# EAGLE schematic All-in-one Starter Kit for Arduino Nano R4 V1.0 (EAGLE 9.6.2)
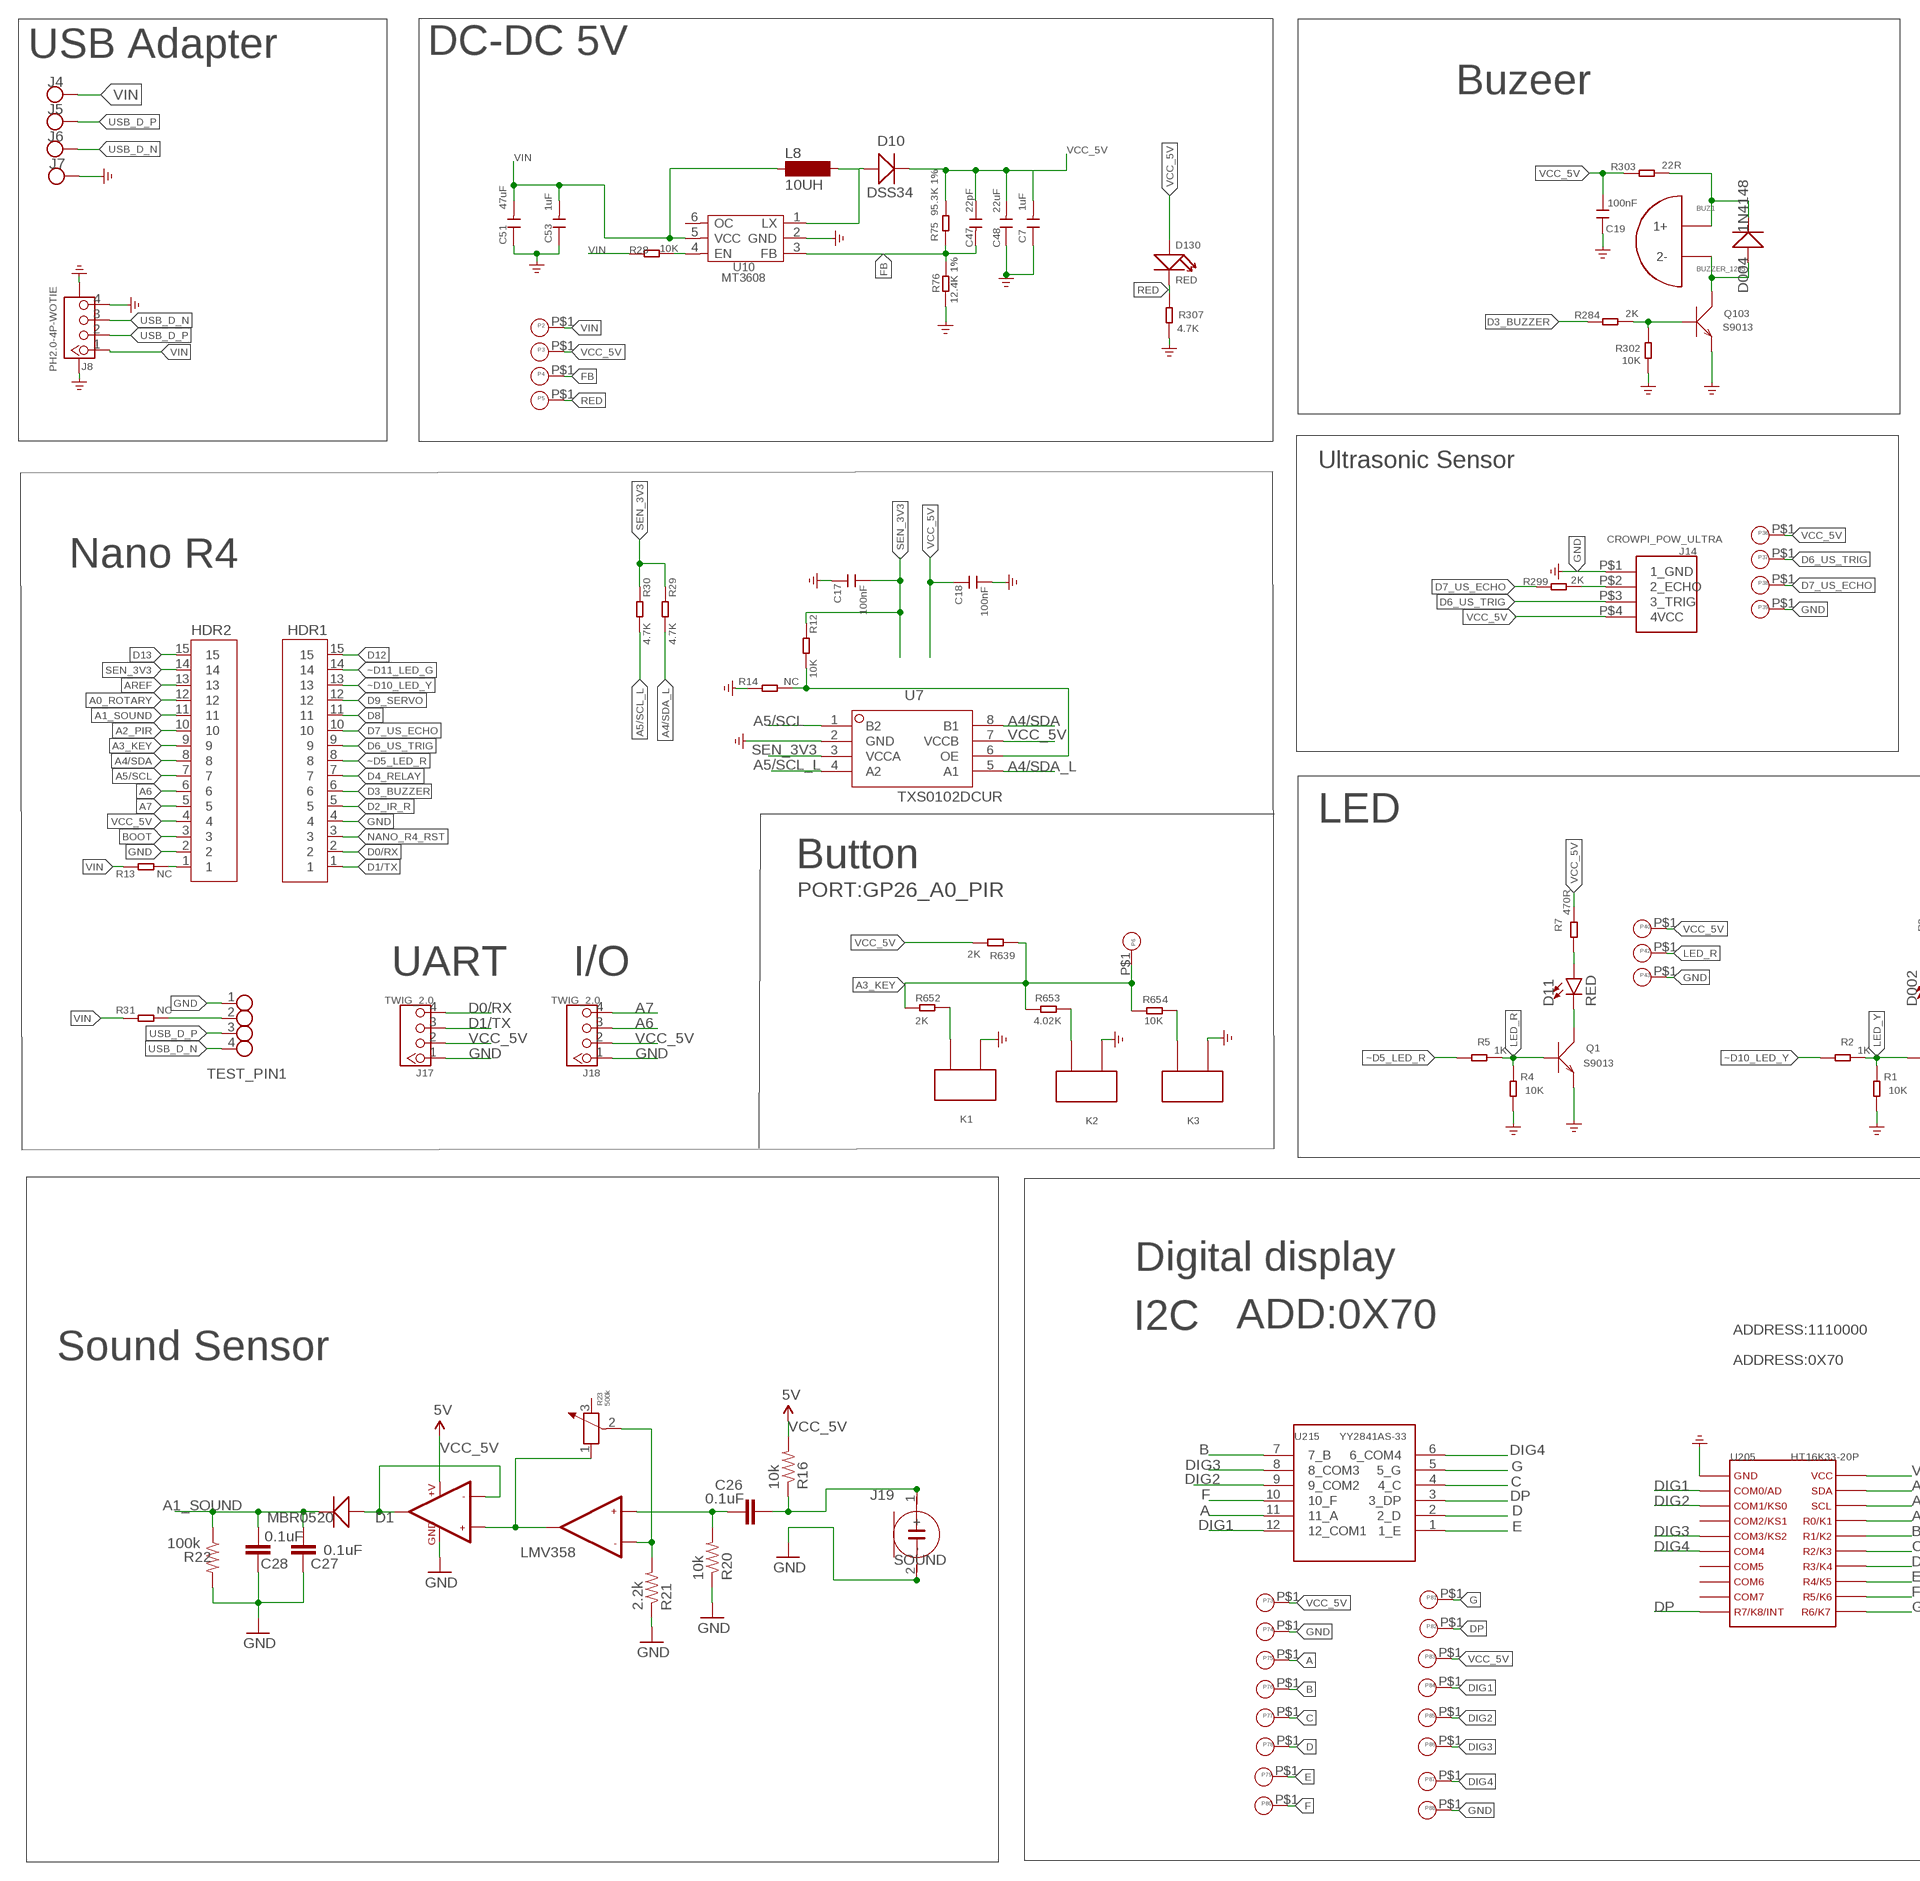
[diagram p0: schematic, sheet 1, part 1 of 2]
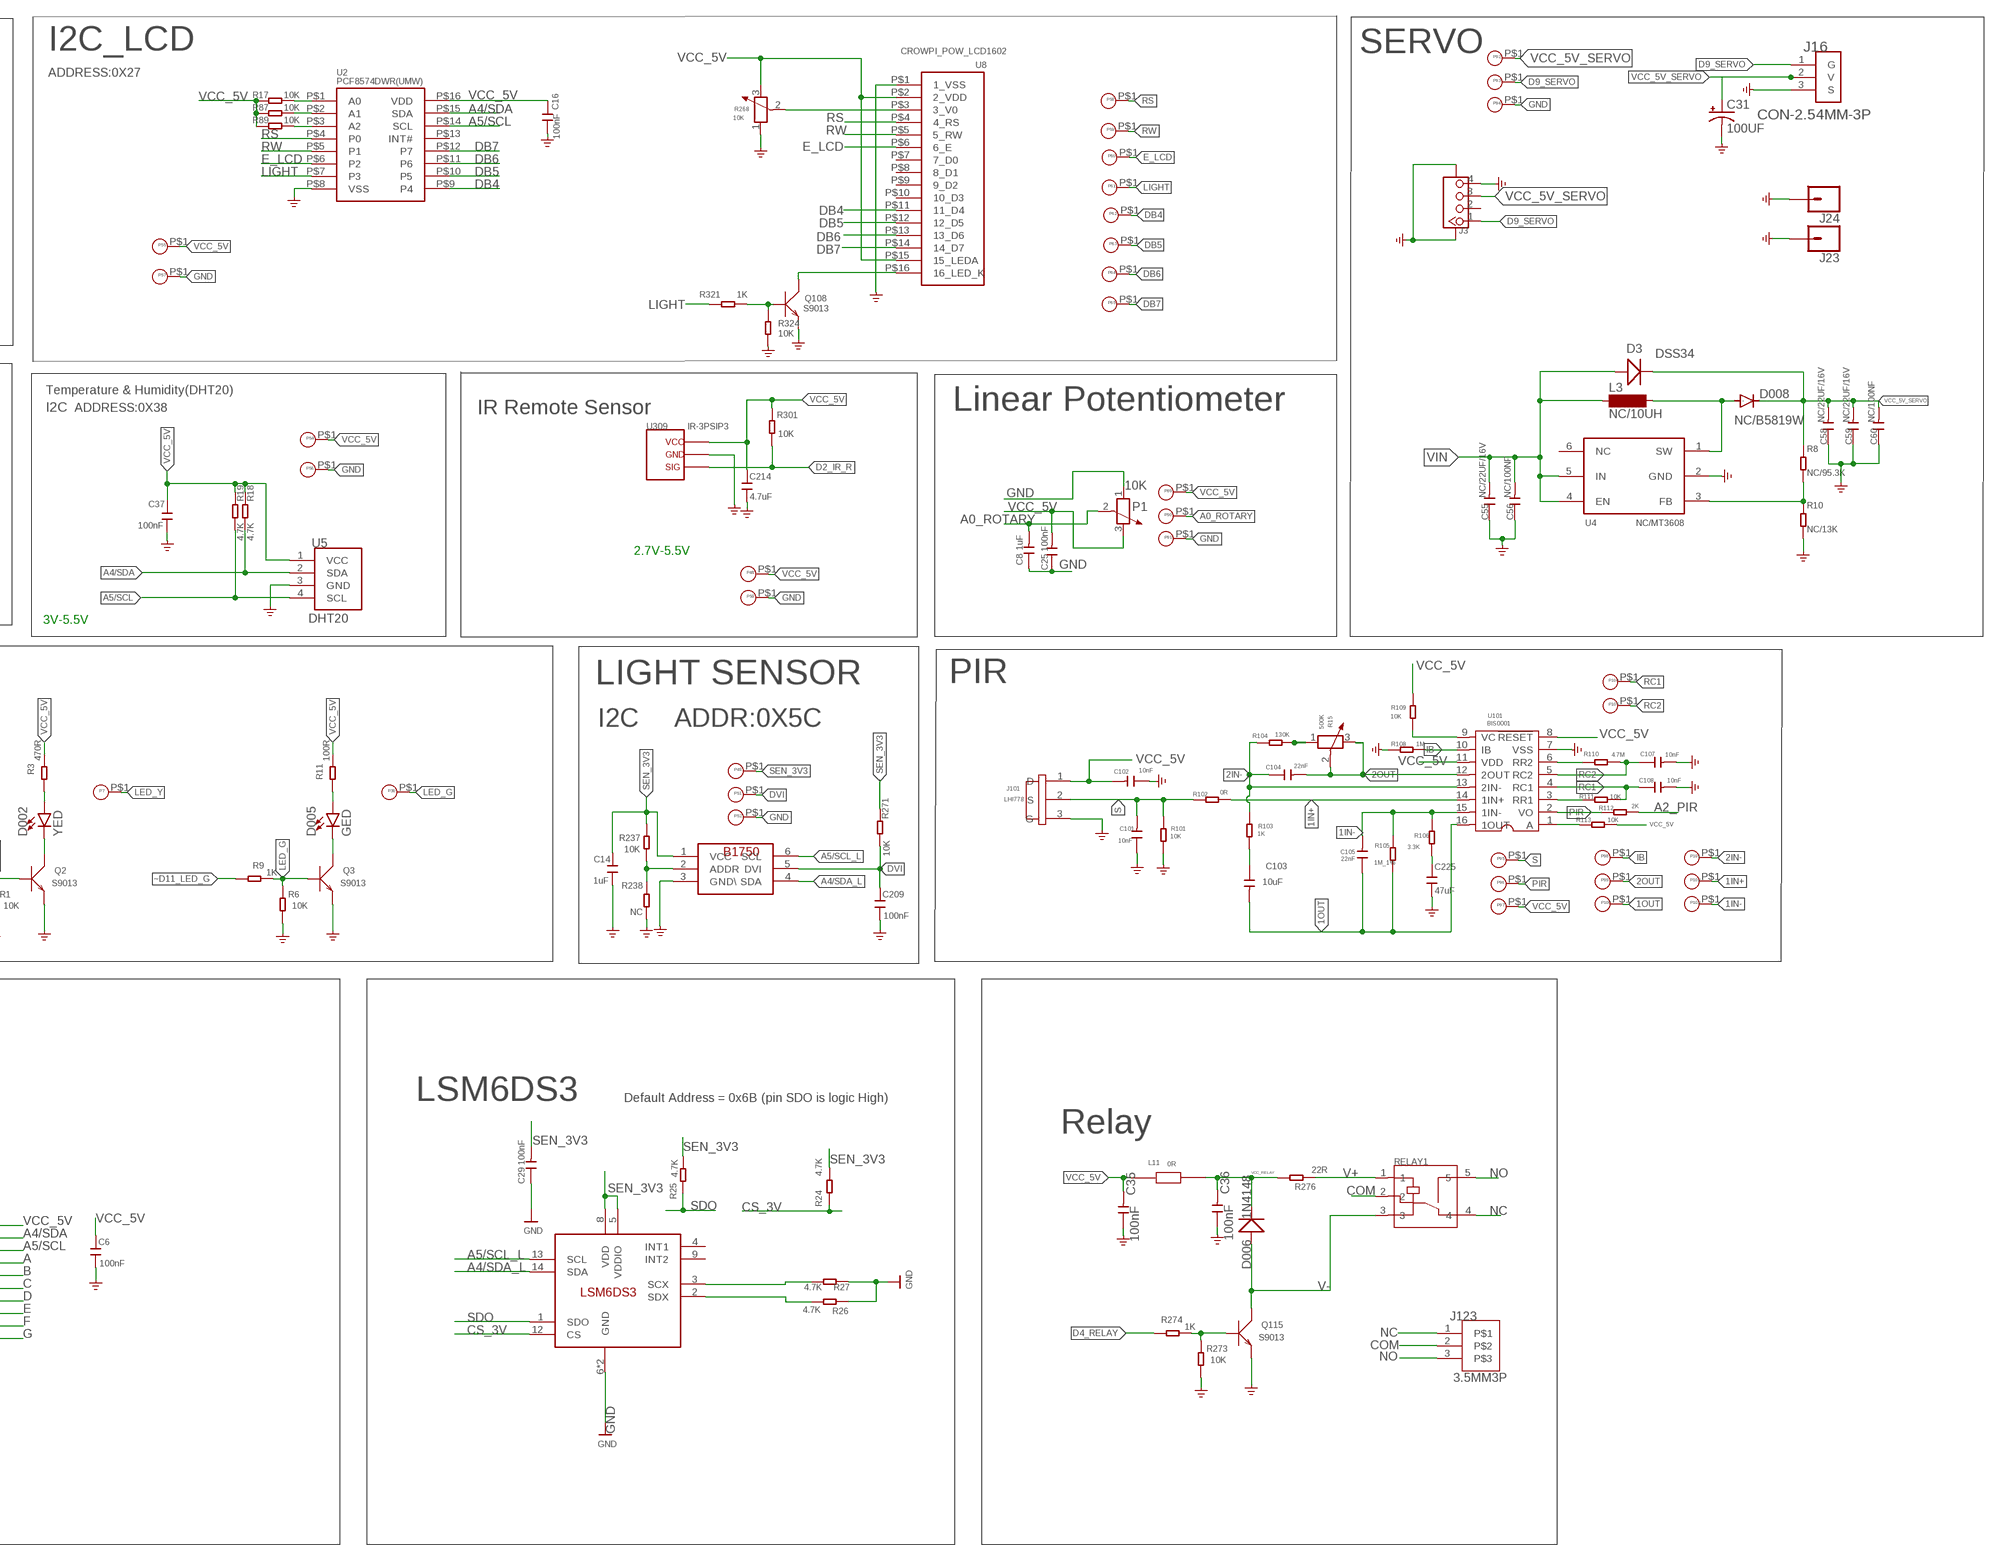
[diagram p1: schematic, sheet 1, part 2 of 2]

## Parts
BUZ1  BUZZER_1295  BUZZERBUZZER_1295_DIP  [BUZZER-D12MM-DIP2]
C6  100nF  C0603  [0603]
C7  1uF  CAP  [C0603]
C8  1uF  C-0603  [C0603]
C14  1uF  C0603  [0603]
C16  100nF  C0603  [0603]
C17  100nF  C0603  [0603]
C18  100nF  C0603  [0603]
C19  100nF  C0603  [0603]
C25  100nF  C-0603  [C0603]
C26  0.1uF  CAP0603-CAP  [0603-CAP]
C27  0.1uF  CAP0603-CAP  [0603-CAP]
C28  0.1uF  CAP0603-CAP  [0603-CAP]
C29  100nF  C-0603  [C0603]
C31  100UF  CPOL-USSANYO_SMD_C6  [SANYO-OSCON_SMD_C6]
C35  100nF  C-0603  [C0603]
C36  100nF  C-0603  [C0603]
C37  100nF  C0603  [0603]
C47  22pF  CAP  [C0603]
C48  22uF  CAPC0805  [C0805]
C51  47uF  CAPC0805  [C0805]
C53  1uF  CAP  [C0603]
C55  NC/22UF/16V  CAP  [C0603]
C56  NC/100NF  CAP  [C0603]
C58  NC/22UF/16V  CAP  [C0603]
C59  NC/22UF/16V  CAP  [C0603]
C60  NC/100NF  CAP  [C0603]
C101  10nF  C-0603  [C0603]
C102  10nF  C-0603  [C0603]
C103  10uF  C0603  [0603]
C104  22nF  C-0603  [C0603]
C105  22nF  C-0603  [C0603]
C107  10nF  C-0603  [C0603]
C108  10nF  C-0603  [C0603]
C209  100nF  C0603  [0603]
C214  4.7uF  C0603  [0603]
C225  47uF  C0805  [0805]
D1  MBR0520  D'MBR0520LT1'  [SOD123-2.7X1.6]
D002  YED  LED  [LED-8MM]
D3  DSS34  DIODE  [D_SOD123FL]
D004  1N4148  DIODE1206  [D_SOD123]
D005  GED  LED  [LED-8MM]
D006  1N4148  DIODE1206  [D_SOD123]
D008  NC/B5819W  CGRM4001-G  [SOD-123_MINI-SMA]
D10  DSS34  DIODE  [D_SOD123FL]
D11  RED  LED  [LED-8MM]
D130  RED  LED_0603_SMT  [LED_0603_SMT]
HDR1  KH-2.54FH-1X15P-H8.5  [HDR-TH_15P-P2.54-V-F]
HDR2  KH-2.54FH-1X15P-H8.5  [HDR-TH_15P-P2.54-V-F]
J3  A_XBJ_CONNECTOR_TWIG-4P-2.0-SMD-FEMALE-REINFORCE90D  [A_XBJ_CONNECTOR_4P-SMD-2.0-90D]
J4  TP-SMDTP-SMD-2X4MM  [TP-SMD-2X4MM]
J5  TP-SMDTP-SMD-2X4MM  [TP-SMD-2X4MM]
J6  TP-SMDTP-SMD-2X4MM  [TP-SMD-2X4MM]
J7  TP-SMDTP-SMD-2X4MM  [TP-SMD-2X4MM]
J8  PH2.0-4P-WOTIE  [PH2.0-4P]
J14  CROWPI_POW_ULTRA  [CROWPI_POW_ULTRA]
J16  CON-2.54MM-3P  CON-2.54MM-13P-WT-SG90  [CON-PZ-2.54MM-1*3P-WT]
J17  TWIG_2.0  [2.0_1X4]
J18  TWIG_2.0  [2.0_1X4]
J19  SOUND  TEMPLATE_MICROPHONE  [TEMPLATE_2P-D8.9MM]
J23  CONN_01_2.6MM1X01_2.6-4MM  [1X01_2.6MM]
J24  CONN_01_2.6MM1X01_2.6-4MM  [1X01_2.6MM]
J101  LHI778  [3P-D8.1MM]
J123  3.5MM3P  [3.5MM*3P]
K1  BUTTON_2P  [BUTTON_2P]
K2  BUTTON_2P  [BUTTON_2P]
K3  BUTTON_2P  [BUTTON_2P]
L3  NC/10UH  MS42  [MS42]
L8  10UH  MS42  [MS42]
L11  0R  CMP201209UD1R0MT201209  [201209]
P1  10K  R-POTENTIOMETER  [3P-SQUA-45.6X10X5.8H]
P2  PADPAD-1.0MM  [PAD-1.0MM]
P3  PADPAD-1.0MM  [PAD-1.0MM]
P4  PADPAD-1.0MM  [PAD-1.0MM]
P5  PADPAD-1.0MM  [PAD-1.0MM]
P6  PADPAD-1.0MM  [PAD-1.0MM]
P7  PADPAD-1.0MM  [PAD-1.0MM]
P30  PADPAD-1.0MM  [PAD-1.0MM]
P36  PADPAD-1.0MM  [PAD-1.0MM]
P37  PADPAD-1.0MM  [PAD-1.0MM]
P38  PADPAD-1.0MM  [PAD-1.0MM]
P39  PADPAD-1.0MM  [PAD-1.0MM]
P40  PADPAD-1.0MM  [PAD-1.0MM]
P42  PADPAD-1.0MM  [PAD-1.0MM]
P43  PADPAD-1.0MM  [PAD-1.0MM]
P48  PADPAD-1.0MM  [PAD-1.0MM]
P49  PADPAD-1.0MM  [PAD-1.0MM]
P50  PADPAD-1.0MM  [PAD-1.0MM]
P51  PADPAD-1.0MM  [PAD-1.0MM]
P52  PADPAD-1.0MM  [PAD-1.0MM]
P54  PADPAD-1.0MM  [PAD-1.0MM]
P55  PADPAD-1.0MM  [PAD-1.0MM]
P56  PADPAD-1.0MM  [PAD-1.0MM]
P57  PADPAD-1.0MM  [PAD-1.0MM]
P58  PADPAD-1.0MM  [PAD-1.0MM]
P59  PADPAD-1.0MM  [PAD-1.0MM]
P60  PADPAD-1.0MM  [PAD-1.0MM]
P61  PADPAD-1.0MM  [PAD-1.0MM]
P62  PADPAD-1.0MM  [PAD-1.0MM]
P63  PADPAD-1.0MM  [PAD-1.0MM]
P64  PADPAD-1.0MM  [PAD-1.0MM]
P65  PADPAD-1.0MM  [PAD-1.0MM]
P73  PADPAD-1.0MM  [PAD-1.0MM]
P74  PADPAD-1.0MM  [PAD-1.0MM]
P75  PADPAD-1.0MM  [PAD-1.0MM]
P76  PADPAD-1.0MM  [PAD-1.0MM]
P77  PADPAD-1.0MM  [PAD-1.0MM]
P78  PADPAD-1.0MM  [PAD-1.0MM]
P79  PADPAD-1.0MM  [PAD-1.0MM]
P80  PADPAD-1.0MM  [PAD-1.0MM]
P81  PADPAD-1.0MM  [PAD-1.0MM]
P82  PADPAD-1.0MM  [PAD-1.0MM]
P83  PADPAD-1.0MM  [PAD-1.0MM]
P84  PADPAD-1.0MM  [PAD-1.0MM]
P85  PADPAD-1.0MM  [PAD-1.0MM]
P86  PADPAD-1.0MM  [PAD-1.0MM]
P87  PADPAD-1.0MM  [PAD-1.0MM]
P88  PADPAD-1.0MM  [PAD-1.0MM]
P89  PADPAD-1.0MM  [PAD-1.0MM]
P90  PADPAD-1.0MM  [PAD-1.0MM]
P91  PADPAD-1.0MM  [PAD-1.0MM]
P92  PADPAD-1.0MM  [PAD-1.0MM]
P93  PADPAD-1.0MM  [PAD-1.0MM]
P94  PADPAD-1.0MM  [PAD-1.0MM]
P95  PADPAD-1.0MM  [PAD-1.0MM]
P96  PADPAD-1.0MM  [PAD-1.0MM]
P97  PADPAD-1.0MM  [PAD-1.0MM]
P98  PADPAD-1.0MM  [PAD-1.0MM]
P99  PADPAD-1.0MM  [PAD-1.0MM]
P100  PADPAD-1.0MM  [PAD-1.0MM]
P101  PADPAD-1.0MM  [PAD-1.0MM]
P102  PADPAD-1.0MM  [PAD-1.0MM]
P103  PADPAD-1.0MM  [PAD-1.0MM]
P104  PADPAD-1.0MM  [PAD-1.0MM]
P105  PADPAD-1.0MM  [PAD-1.0MM]
Q1  S9013  TRANSISTOR-NPN-SOT23  [SOT23@1]
Q2  S9013  TRANSISTOR-NPN-SOT23  [SOT23@1]
Q3  S9013  TRANSISTOR-NPN-SOT23  [SOT23@1]
Q103  S9013  TRANSISTOR-NPN-SOT23  [SOT23@1]
Q108  S9013  TRANSISTOR-NPN-SOT23  [SOT23@1]
Q115  S9013  TRANSISTOR-NPN-SOT23  [SOT23@1]
R1  10K  R-0603  [R0603]
R2  1K  R-0603  [R0603]
R3  470R  R-0603  [R0603]
R4  10K  R-0603  [R0603]
R5  1K  R-0603  [R0603]
R6  10K  R-0603  [R0603]
R7  470R  R-0603  [R0603]
R8  NC/95.3K  RESR0603  [R0603]
R9  1K  R-0603  [R0603]
R10  NC/13K  RESR0603  [R0603]
R11  100R  R-0603  [R0603]
R12  10K  R0603  [R0603]
R13  NC  R0603  [R0603]
R14  NC  R0603  [R0603]
R15  500K  R-POTENTIOMETER-SMD  [3P-SMD-SQUA-3.6X3.3]
R16  10k  RESISTOR0603-RES  [0603-RES]
R17  10K  R0603  [R0603]
R18  4.7K  R0603  [R0603]
R19  4.7K  R0603  [R0603]
R20  10k  RESISTOR0603-RES  [0603-RES]
R21  2.2k  RESISTOR0603-RES  [0603-RES]
R22  100k  RESISTOR0603-RES  [0603-RES]
R23  500k  R-POTENTIOMETER-SMD  [3P-SMD-SQUA-3.6X3.3]
R24  4.7K  R-0603  [R0603]
R25  4.7K  R-0603  [R0603]
R26  4.7K  R-0603  [R0603]
R27  4.7K  R-0603  [R0603]
R28  10K  RES-0603  [R0603-SP]
R29  4.7K  R0603  [R0603]
R30  4.7K  R0603  [R0603]
R31  NC  R0603  [R0603]
R75  95.3K 1%  RES-0603  [R0603-SP]
R76  12.4K 1%  RES-0603  [R0603-SP]
R87  10K  R0603  [R0603]
R89  10K  R0603  [R0603]
R101  10K  R-0603  [R0603]
R102  0R  R-0603  [R0603]
R103  1K  R-0603  [R0603]
R104  130K  R-0603  [R0603]
R105  1M_1%  R-0603  [R0603]
R106  3.3K  R-0603  [R0603]
R108  1M  R-0603  [R0603]
R109  10K  R-0603  [R0603]
R110  4.7M  R-0603  [R0603]
R111  10K  R-0603  [R0603]
R112  2K  R-0603  [R0603]
R113  10K  R-0603  [R0603]
R237  10K  R0603  [R0603]
R238  NC  R0603  [R0603]
R268  10K  R-POTENTIOMETER-SMD  [3P-SMD-SQUA-3.6X3.3]
R271  10K  R0603  [R0603]
R273  10K  R-0603  [R0603]
R274  1K  R-0603  [R0603]
R276  22R  R-0603  [R0603]
R284  2K  R0603  [R0603]
R299  2K  R0603  [R0603]
R301  10K  R0603  [R0603]
R302  10K  R0603  [R0603]
R303  22R  R0603  [R0603]
R307  4.7K  R0603  [R0603]
R321  1K  R0603  [R0603]
R324  10K  R0603  [R0603]
R639  2K  RESR0603  [R0603]
R652  2K  RESR0603  [R0603]
R653  4.02K  RESR0603  [R0603]
R654  10K  RESR0603  [R0603]
RELAY1  RELAY-SRD  [REY5-6-19.1X15.5X15.3MM]
TEST_PIN1  POGOPIN_4  [POGOPIN_4]
U1  BH1750  [BH1750-WSOF-6]
U2  PCF8574DWR(UMW)  PCF8574T/TR  [SO-16-300MIL]
U3  LSM6DS3  [LGA-14L]
U4  NC/MT3608  MT3608  [DBV_R-PDSO-G6]
U5  DHT20  CROWTAIL-DHT20-V1.0-20211013_DHT20  [CROWTAIL-DHT20-V1.0-20211013_DHT20]
U6  LMV358  [SO08]
U7  TXS0102DCUR  [VSSOP-8]
U8  CROWPI_POW_LCD1602  [CROWPI_POW_LCD1206]
U10  MT3608  STUDY_SX1301  [SOT23-6L]
U101  BIS0001  TM2291  [SOP16]
U205  HT16K33-20P  [HT16K33-SOP20]
U215  YY2841AS-33  4-DIGITAL_DISPLAY  [4-DIGITAL_DISPLAY]
U309  IR-3PSIP3  [VS1838B-SIP3]

## Nets
1IN+: P102.P$1 R102.1 U101.14(1IN+)
1IN-: C105.2 P103.P$1 R105.2 R106.2 U101.15(1IN-)
1OUT: C103.2 C105.1 P100.P$1 R105.1 U101.16(1OUT)
2IN-: C104.1 P101.P$1 R103.2 R104.2 U101.13(2IN-)
2OUT: C104.2 P99.P$1 R15.2 R15.3 U101.12(2OUT)
A: P75.P$1 U205.P$17 U215.11(11_A)
A0_ROTARY: C8.2 HDR2.12 P1.2 P90.P$1
A1_SOUND: C27.2 C28.2 D1.2(-) HDR2.11 R22.1
A2_PIR: HDR2.10 R112.1
A3_KEY: HDR2.9 P6.P$1 R639.2 R652.2 R653.2 R654.2
A4/SDA: HDR2.8 R18.2 U2.P$15(SDA) U5.2(SDA) U7.8(B1) U205.P$19
A4/SDA_L: R29.2 U1.4(SDA) U3.14(SDA) U7.5(A1)
A5/SCL: HDR2.7 R19.2 U2.P$14(SCL) U5.4(SCL) U7.1(B2) U205.P$18
A5/SCL_L: R30.2 U1.6(SCL) U3.13(SCL) U7.4(A2)
A6: HDR2.6 J18.3
A7: HDR2.5 J18.4
AREF: HDR2.13
B: P76.P$1 U205.P$16 U215.7(7_B)
BOOT: HDR2.3
C: P77.P$1 U205.P$15 U215.4(4_C)
COM: J123.2 RELAY1.2
CS_3V: R24.1 U3.12(CS)
D: P78.P$1 U205.P$14 U215.2(2_D)
D0/RX: HDR1.2 J17.4
D1/TX: HDR1.1 J17.3
D2_IR_R: HDR1.5 R301.2 U309.3
D3_BUZZER: HDR1.6 R284.1
D4_RELAY: HDR1.7 R274.2
D6_US_TRIG: HDR1.9 J14.P$3(3_TRIG) P37.P$1
D7_US_ECHO: HDR1.10 P38.P$1 R299.2
D8: HDR1.11
D9_SERVO: HDR1.12 J3.1 J16.1(G) P93.P$1
D12: HDR1.15
D13: HDR2.15
DB4: P62.P$1 U2.P$9(P4) U8.P$11(11_D4)
DB5: P63.P$1 U2.P$10(P5) U8.P$12(12_D5)
DB6: P64.P$1 U2.P$11(P6) U8.P$13(13_D6)
DB7: P65.P$1 U2.P$12(P7) U8.P$14(14_D7)
DIG1: P84.P$1 U205.P$2 U215.12(12_COM1)
DIG2: P85.P$1 U205.P$3 U215.9(9_COM2)
DIG3: P86.P$1 U205.P$5 U215.8(8_COM3)
DIG4: P87.P$1 U205.P$6 U215.6(6_COM4)
DP: P82.P$1 U205.P$10 U215.3(3_DP)
DVI: C209.2 P51.P$1 R271.2 U1.5(DVI)
E: P79.P$1 U205.P$13 U215.1(1_E)
E_LCD: P60.P$1 U2.P$6(P2) U8.P$6(6_E)
F: P80.P$1 U205.P$12 U215.10(10_F)
FB: C47.2 P4.P$1 R75.1 R76.2 U10.3(FB)
G: P81.P$1 U205.P$11 U215.5(5_G)
GND: C6.1 C7.1 C8.1 C14.1 C16.1 C17.2 C18.1 C19.2 C25.1 C27.1 C28.1 C29.1 C31.- C35.1 C36.1 C37.1 C48.1 C51.1 C53.1 C55.1 C56.1 C58.1 C59.1 C60.1 C101.1 C102.1 C107.2 C108.2 C209.1 C214.1 C225.1 HDR1.4 HDR2.2 J3.4 J3.SS1 J3.SS2 J7.1 J8.4 J8.5(SS1) J8.6(SS2) J14.P$1(1_GND) J16.3(S) J17.1 J18.1 J19.2(-) J23.1 J24.1 J101.3(G) K1.P$1 K2.P$1 K3.P$1 P1.1 P39.P$1 P43.P$1 P50.P$1 P52.P$1 P56.P$1 P57.P$1 P74.P$1 P88.P$1 P91.P$1 P94.P$1 Q1.2(E) Q2.2(E) Q3.2(E) Q103.2(E) Q108.2(E) Q115.2(E) R1.1 R4.1 R6.1 R10.2 R14.1 R20.1 R21.1 R22.2 R26.1 R27.1 R76.1 R101.1 R108.1 R238.1 R268.1 R273.1 R302.1 R307.2 R324.2 TEST_PIN1.1 U1.3(GND\) U2.P$8(VSS) U3.6(GND) U3.7(GND) U4.2(GND) U5.3(GND) U6.4(GND) U7.2(GND) U8.P$1(1_VSS) U10.2(GND) U101.7(VSS) U205.P$1 U309.2 ; supply symbol labelled POWER-OR-GND-_GND_POWER
IB: P98.P$1 R108.2 U101.10(IB)
LED_G: P30.P$1 Q3.1(B) R6.2 R9.1
LED_R: P42.P$1 Q1.1(B) R4.2 R5.1
LED_Y: P7.P$1 Q2.1(B) R1.2 R2.1
LIGHT: P61.P$1 R321.2 U2.P$7(P3)
N$1: R111.1 U101.3(RR1)
N$2: Q108.1(B) R321.1 R324.1
N$3: C225.2 R106.1
N$4: D10.+ L8.2 U10.1(LX)
N$5: D002.2(C) Q2.3(C)
N$6: R28.2 U10.4(EN)
N$7: R268.2 U8.P$3(3_V0)
N$8: D002.1(A) R3.2
N$9: D005.2(C) Q3.3(C)
N$10: R17.2 U2.P$1(A0)
N$11: R87.2 U2.P$2(A1)
N$12: R89.2 U2.P$3(A2)
N$13: D008.A L3.2 U4.1(SW)
N$14: D005.1(A) R11.2
N$15: D11.2(C) Q1.3(C)
N$16: D11.1(A) R7.2
N$17: R31.1 TEST_PIN1.2
N$19: HDR2.1 R13.1
N$20: Q108.3(C) U8.P$16(16_LED_K)
N$24: R12.2 R14.2 U7.6(OE)
N$25: R110.2 U101.6(RR2)
N$29: R109.2 U101.9(VC)
N$35: C103.1 R103.1
N$36: R8.2 R10.1 U4.3(FB)
N$37: R113.2 U101.1(A)
N$39: R15.1 R104.1
N$40: C26.1 J19.1(+) R16.1
N$41: C26.2 R20.2 U6.5(+IN2)
N$42: R21.2 R23.2 U6.6(-IN2)
N$43: D1.1(+) U6.1(OUT1) U6.2(-IN1)
N$44: R23.1 U6.3(+IN1) U6.7(OUT2)
N$45: R26.2 U3.2(SDX)
N$46: R27.2 U3.3(SCX)
N$166: K1.P$2 R652.1
N$168: K2.P$2 R653.1
N$169: K3.P$2 R654.1
N$258: R237.1 R238.2 U1.2(ADDR)
N$259: Q115.1(B) R273.2 R274.1
N$278: J14.P$2(2_ECHO) R299.1
N$279: Q103.1(B) R284.2 R302.2
N$280: BUZ1.2(2-) D004.+ Q103.3(C)
N$281: BUZ1.1(1+) D004.- R303.2
NANO_R4_RST: HDR1.3
NC: J123.1 RELAY1.4
NO: J123.3 RELAY1.5
PIR: P96.P$1 R112.2 U101.2(VO)
RC1: C108.1 P104.P$1 R111.2 U101.4(RC1)
RC2: C107.1 P105.P$1 R110.1 U101.5(RC2)
RED: D130.2(2_K) P5.P$1 R307.1
RS: P58.P$1 U2.P$4(P0) U8.P$4(4_RS)
RW: P59.P$1 U2.P$5(P1) U8.P$5(5_RW)
S: C101.2 J101.2(S) P95.P$1 R101.2 R102.2
SDO: R25.1 U3.1(SDO)
SEN_3V3: C14.2 C17.1 C29.2 HDR2.14 P49.P$1 R12.1 R24.2 R25.2 R29.1 R30.1 R237.2 R271.1 U1.1(VCC) U3.5(VDDIO) U3.8(VDD) U7.3(VCCA)
USB_D_N: J6.1 J8.3 TEST_PIN1.4
USB_D_P: J5.1 J8.2 TEST_PIN1.3
V+: R276.2 RELAY1.1
V-: D006.+ Q115.3(C) RELAY1.3
VCC_5V: C6.2 C7.2 C16.2 C18.2 C19.1 C25.2 C35.2 C37.2 C47.1 C48.2 C102.2 C214.2 D10.- D130.1(1_A) HDR2.4 J14.P$4(4VCC) J17.2 J18.2 J101.1(D) L11.1 P1.3 P3.P$1 P36.P$1 P40.P$1 P48.P$1 P54.P$1 P55.P$1 P73.P$1 P83.P$1 P89.P$1 P97.P$1 R3.1 R7.1 R11.1 R16.2 R17.1 R18.1 R19.1 R75.2 R87.1 R89.1 R109.1 R113.1 R268.3 R301.1 R303.1 R639.1 U2.P$16(VDD) U5.1(VCC) U6.8(+V) U7.7(VCCB) U8.P$2(2_VDD) U8.P$15(15_LEDA) U101.8(!RESET) U101.11(VDD) U205.P$20 U309.1 ; supply symbol labelled 5V
VCC_5V_SERVO: C31.+ C58.2 C59.2 C60.2 D3.- D008.C J3.3 J16.2(V) P92.P$1 R8.1
VCC_RELAY: C36.2 D006.- L11.2 R276.1
VIN: C51.2 C53.2 C55.2 C56.2 D3.+ J4.1 J8.1 L3.1 L8.1 P2.P$1 R13.2 R28.1 R31.2 U4.4(EN) U4.5(IN) U10.5(VCC)
~D5_LED_R: HDR1.8 R5.2
~D10_LED_Y: HDR1.13 R2.2
~D11_LED_G: HDR1.14 R9.2
Unconnected: J3.2 R23.3 U2.P$13(INT#) U3.4(INT1) U3.9(INT2) U4.6(NC) U8.P$7(7_D0) U8.P$8(8_D1) U8.P$9(9_D2) U8.P$10(10_D3) U10.6(OC) U205.P$4 U205.P$7 U205.P$8 U205.P$9

## Notes on the sheet
- USB Adapter | DC-DC 5V | I2C_LCD | SERVO
- ADDRESS:0X27
- Buzeer
- Ultrasonic Sensor
- Temperature & Humidity(DHT20)
- I2C | ADDRESS:0X38 | IR Remote Sensor | Linear Potentiometer
- Nano R4
- 2.7V-5.5V
- 3V-5.5V
- LED | LIGHT SENSOR | PIR
- Button | I2C | ADDR:0X5C
- PORT:GP26_A0_PIR
- UART | I/O
- Digital display
- I2C | ADD:0X70 | LSM6DS3 | Default Address = 0x6B (pin SDO is logic High)
- ADDRESS:1110000
- Sound Sensor
- ADDRESS:0X70 | Relay
- LMV358

## Library data of the parts
BUZ1 = Crowtail_Starter:BUZZER
C6 C14 C16-C19 C37 C209 C214 = cooper:C0603
C7 C47 C48 C51 C53 = LoraWAN_Gateway_Mainboard:CAP*
C8 C25 C29 C35 C36 C101 C102 C104 C105 C107 C108 = Discrete:C*: Ceramic Capacitors
C26-C28 = SparkFun:CAP: Capacitor Standard 0603 ceramic capacitor, and 0.1" leaded capacitor.
C31 = rcl:CPOL-US: POLARIZED CAPACITOR, American symbol; SPICEPREFIX: C
C55 C56 C58-C60 = SX1302_Module:CAP*
C103 = A_xbj:C0603
C225 = cooper:C0805
D1 = Discrete:D*
D002 D005 D11 = Crowtail_Starter:LED: LED (Generic) Standard schematic elements and footprints for 5mm, 3mm, 1206, and 0603 sized LEDs. Generic LEDs with no color specified.
D3 D10 = CrowPanel_Advance_HMI:DIODE*
D004 D006 = Crowtail_Starter:DIODE*
D008 = diode:CGRM400*-G: Molded plasitc,JEDEC SOD-123/Mini SMA Source: Comchip CGRM4001-G.pdf
D130 = cooper:LED_0603_SMT
HDR1 HDR2 = 1_15_2.54 HDR:KH-2.54FH-1X15P-H8.5
J3 = CrowPanel ESP32 Display-4.3-inch-V2.1-20240314:A_XBJ_CONNECTOR_TWIG-4P-2.0-SMD-FEMALE-REINFORCE
J4-J7 = Crowtail_Starter:TP-SMD
J8 = CrowPanel ESP32 Display-4.3-inch-V2.1-20240314:PH2.0-4P-WOTIE
J14 = Crowtail_Starter_V0.2:CROWPI_POW_ULTRA
J16 = Brian:CON-2.54MM-1*3P-WT-SG90
J17 J18 = CONNECTER:TWIG_2.0
J19 = Crowpi_laptop-MB-V1.0-20200623-01:TEMPLATE_MICROPHONE
J23 J24 = SparkFun-Connectors2.6:CONN_01_2.6MM: Single connection point. Often used as Generic Header-pin footprint for 0.1 inch spaced/style header connections On any of the 0.1 inch spaced packages, you can populate with these: Break Away Headers - Straight <https://www.sparkfun.com/products/116> (PRT-00116) Break Away Male Headers - Right Angle <https://www.sparkfun.com/products/553> (PRT-00553) Female Headers <https://www.sparkfun.com/products/115> (PRT-00115) Break Away Headers - Machine Pin <https://www.sparkfun.com/products/117> (PRT-00117) Break Away Female Headers - Swiss Machine Pin <https://www.sparkfun.com/products/743> (PRT-00743) This device is also useful as a general connection point to wire up your design to another part of your project. Our various solder wires solder well into these plated through hole pads. Hook-Up Wire - Assortment (Stranded, 22 AWG) <https://www.sparkfun.com/products/11375> (PRT-11375) Hook-Up Wire - Assortment (Solid Core, 22 AWG) <https://www.sparkfun.com/products/11367> (PRT-11367) View the entire wire category on our website here <https://www.sparkfun.com/categories/141> Special notes: SMTSO-256-ET is a "flush mount" nut for a 4-40 screw. We mostly use this on specialty testbeds; it is a nice way to connect hardware to your PCB at an adjustable hieght. Also note, the SNAP packages are for using a snappable style connector. We sell a baggie of snaps and they are also used on two LilyPad designs: Snap Assortment - 30 pack (male and female) <https://www.sparkfun.com/products/11347> (DEV-11347) LilyPad Arduino SimpleSnap <https://www.sparkfun.com/products/10941> (DEV-10941) LilyPad SimpleSnap Protoboard <https://www.sparkfun.com/products/10940> (DEV-10940)
J101 = PIR_motion_sensor:LHI778: Pyroelectric Infrared Detectors
J123 = Crowtail_Starter:3.5MM*3P
K1-K3 = crowpi_pow:BUTTON_2P
L3 L8 = Library:MS42: INDUCTOR SMD inductor; OC_FARNELL: unknown; OC_NEWARK: unknown
L11 = CrowPi2-MB-V1.4-20211012:CMP201209UD1R0MT
P1 R15 R23 R268 = Discrete:R-POTENTIOMETER*: Potentiometer
P2-P7 P30 P36-P40 P42 P43 P48-P52 P54-P65 P73-P105 = crowpi_pow:PAD*
Q1-Q3 Q103 Q108 Q115 = Discrete:TRANSISTOR-NPN*: NPN audion
R1-R7 R9 R11 R24-R27 R101-R106 R108-R113 R273 R274 R276 = Discrete:R*
R8 R10 R639 R652-R654 = Brian:RES*
R12-R14 R17-R19 R29-R31 R87 R89 R237 R238 R271 R284 R299 R301-R303 R307 R321 R324 = cooper:R0603
R16 R20-R22 = SparkFun:RESISTOR: Resistor Basic schematic elements and footprints for 0603, 1206, and PTH resistors.
R28 R75 R76 = LoraWAN_Gateway_Mainboard:RES*
RELAY1 = Discrete-new:RELAY-SRD
TEST_PIN1 = Library:POGOPIN_4
U1 = Crowtail_Starter:BH1750
U2 = Brian:PCF8574T/TR
U3 = adafruit_sensor:LSM6DS3
U4 = Library:MT3608
U5 = Crowtail_Starter:CROWTAIL-DHT20-V1.0-20211013_DHT20
U6 = SparkFun:LMV358
U7 = WGH:TXS0102DCUR
U8 = Crowtail_Starter_V0.2:CROWPI_POW_LCD1602
U10 = CrowPanel_Advance_HMI:STUDY_SX1301
U101 = PIR_motion_sensor:TM2291: Infrared signal processor
U205 = crowpi_pow:HT16K33-20P
U215 = crowpi_pow:4-DIGITAL_DISPLAY
U309 = Crowtail_Starter:IR-3P

## Net classes
1 PWR: width 0.15 mm, drill 0.25 mm
2 gnd: width 0.15 mm, drill 0.3 mm, clearance 0.152 mm